# Altium schematic sheet FPGA_NonIO.SchDoc: FPGA Power & Programming
size A4; DocumentNumber: 8; SheetNumber: 8; SheetTotal: 23; Organization: Altium Limited.; Address1: Level 3, 12a Rodborough Rd; Address2: Frenchs Forest 2086; Address3: NSW; Address4: AUSTRALIA
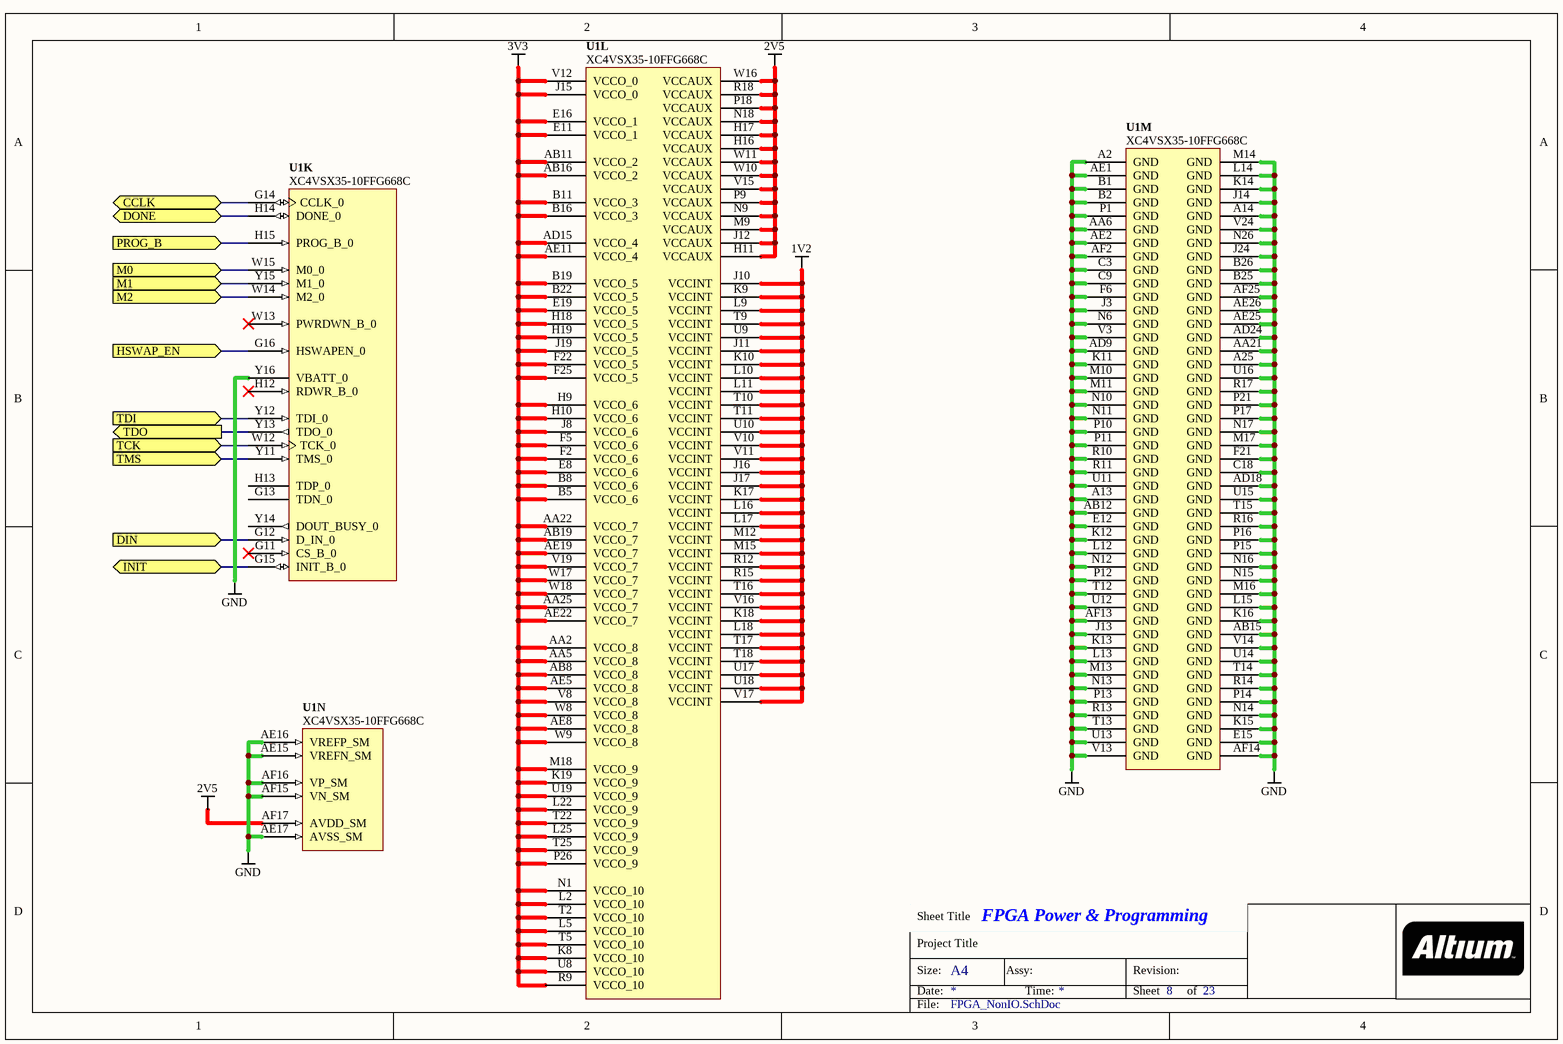
[diagram p0: FPGA_NonIO.SchDoc]

## Parts
U1  XC4VSX35-10FFG668C  [XC4VLX25-10FF668C]  (parts K,L,M,N of 14)

## Ports
CCLK (bidir), DIN (in), DONE (bidir), HSWAP_EN (in), INIT (bidir), M0 (in), M1 (in), M2 (in), PROG_B (in), TCK (in), TDI (in), TDO (out), TMS (in)

## Nets
1V2: U1.J10(VCCINT) U1.J11(VCCINT) U1.J16(VCCINT) U1.J17(VCCINT) U1.K9(VCCINT) U1.K10(VCCINT) U1.K17(VCCINT) U1.K18(VCCINT) U1.L9(VCCINT) U1.L10(VCCINT) U1.L11(VCCINT) U1.L16(VCCINT) U1.L17(VCCINT) U1.L18(VCCINT) U1.M12(VCCINT) U1.M15(VCCINT) U1.R12(VCCINT) U1.R15(VCCINT) U1.T9(VCCINT) U1.T10(VCCINT) U1.T11(VCCINT) U1.T16(VCCINT) U1.T17(VCCINT) U1.T18(VCCINT) U1.U9(VCCINT) U1.U10(VCCINT) U1.U17(VCCINT) U1.U18(VCCINT) U1.V10(VCCINT) U1.V11(VCCINT) U1.V16(VCCINT) U1.V17(VCCINT)
2V5: U1.AF17(AVDD_SM) U1.H11(VCCAUX) U1.H16(VCCAUX) U1.H17(VCCAUX) U1.J12(VCCAUX) U1.M9(VCCAUX) U1.N9(VCCAUX) U1.N18(VCCAUX) U1.P9(VCCAUX) U1.P18(VCCAUX) U1.R18(VCCAUX) U1.V15(VCCAUX) U1.W10(VCCAUX) U1.W11(VCCAUX) U1.W16(VCCAUX)
3V3: U1.AA2(VCCO_8) U1.AA5(VCCO_8) U1.AA22(VCCO_7) U1.AA25(VCCO_7) U1.AB8(VCCO_8) U1.AB11(VCCO_2) U1.AB16(VCCO_2) U1.AB19(VCCO_7) U1.AD15(VCCO_4) U1.AE5(VCCO_8) U1.AE8(VCCO_8) U1.AE11(VCCO_4) U1.AE19(VCCO_7) U1.AE22(VCCO_7) U1.B5(VCCO_6) U1.B8(VCCO_6) U1.B11(VCCO_3) U1.B16(VCCO_3) U1.B19(VCCO_5) U1.B22(VCCO_5) U1.E8(VCCO_6) U1.E11(VCCO_1) U1.E16(VCCO_1) U1.E19(VCCO_5) U1.F2(VCCO_6) U1.F5(VCCO_6) U1.F22(VCCO_5) U1.F25(VCCO_5) U1.H9(VCCO_6) U1.H10(VCCO_6) U1.H18(VCCO_5) U1.H19(VCCO_5) U1.J8(VCCO_6) U1.J15(VCCO_0) U1.J19(VCCO_5) U1.K8(VCCO_10) U1.K19(VCCO_9) U1.L2(VCCO_10) U1.L5(VCCO_10) U1.L22(VCCO_9) U1.L25(VCCO_9) U1.M18(VCCO_9) U1.N1(VCCO_10) U1.P26(VCCO_9) U1.R9(VCCO_10) U1.T2(VCCO_10) U1.T5(VCCO_10) U1.T22(VCCO_9) U1.T25(VCCO_9) U1.U8(VCCO_10) U1.U19(VCCO_9) U1.V8(VCCO_8) U1.V12(VCCO_0) U1.V19(VCCO_7) U1.W8(VCCO_8) U1.W9(VCCO_8) U1.W17(VCCO_7) U1.W18(VCCO_7)
GND: U1.A2(GND) U1.A13(GND) U1.A14(GND) U1.A25(GND) U1.AA6(GND) U1.AA21(GND) U1.AB12(GND) U1.AB15(GND) U1.AD9(GND) U1.AD18(GND) U1.AD24(GND) U1.AE1(GND) U1.AE2(GND) U1.AE15(VREFN_SM) U1.AE16(VREFP_SM) U1.AE17(AVSS_SM) U1.AE25(GND) U1.AE26(GND) U1.AF2(GND) U1.AF13(GND) U1.AF14(GND) U1.AF15(VN_SM) U1.AF16(VP_SM) U1.AF25(GND) U1.B1(GND) U1.B2(GND) U1.B25(GND) U1.B26(GND) U1.C3(GND) U1.C9(GND) U1.C18(GND) U1.E12(GND) U1.E15(GND) U1.F6(GND) U1.F21(GND) U1.J3(GND) U1.J13(GND) U1.J14(GND) U1.J24(GND) U1.K11(GND) U1.K12(GND) U1.K13(GND) U1.K14(GND) U1.K15(GND) U1.K16(GND) U1.L12(GND) U1.L13(GND) U1.L14(GND) U1.L15(GND) U1.M10(GND) U1.M11(GND) U1.M13(GND) U1.M14(GND) U1.M16(GND) U1.M17(GND) U1.N6(GND) U1.N10(GND) U1.N11(GND) U1.N12(GND) U1.N13(GND) U1.N14(GND) U1.N15(GND) U1.N16(GND) U1.N17(GND) U1.N26(GND) U1.P1(GND) U1.P10(GND) U1.P11(GND) U1.P12(GND) U1.P13(GND) U1.P14(GND) U1.P15(GND) U1.P16(GND) U1.P17(GND) U1.P21(GND) U1.R10(GND) U1.R11(GND) U1.R13(GND) U1.R14(GND) U1.R16(GND) U1.R17(GND) U1.T12(GND) U1.T13(GND) U1.T14(GND) U1.T15(GND) U1.U11(GND) U1.U12(GND) U1.U13(GND) U1.U14(GND) U1.U15(GND) U1.U16(GND) U1.V3(GND) U1.V13(GND) U1.V14(GND) U1.V24(GND) U1.Y16(VBATT_0)
CCLK: U1.G14(CCLK_0) ; port CCLK
DIN: U1.G12(D_IN_0) ; port DIN
DONE: U1.H14(DONE_0) ; port DONE
HSWAP_EN: U1.G16(HSWAPEN_0) ; port HSWAP_EN
INIT: U1.G15(INIT_B_0) ; port INIT
M0: U1.W15(M0_0) ; port M0
M1: U1.Y15(M1_0) ; port M1
M2: U1.W14(M2_0) ; port M2
PROG_B: U1.H15(PROG_B_0) ; port PROG_B
TCK: U1.W12(TCK_0) ; port TCK
TDI: U1.Y12(TDI_0) ; port TDI
TDO: U1.Y13(TDO_0) ; port TDO
TMS: U1.Y11(TMS_0) ; port TMS

Not connected (* = marked no-connect by the designer): U1 G11(CS_B_0)* G13(TDN_0) H12(RDWR_B_0)* H13(TDP_0) W13(PWRDWN_B_0)* Y14(DOUT_BUSY_0)

## Notes on the sheet
- Sheet Title
- Project Title
- Size:
- Date:
- A4
- Assy:
- Time:
- Revision:
- Sheet
- of
- File:

## Library data of the parts
U1 = D-241-0021: FPGA, Xilinx Virtex-4, XC4VSX35; Supply Voltage: mV; Mounting Technology: Surface Mount; Status: Production; Technology: None; Category: IC-FPGA